# Altium schematic sheet dzmitry_tamashevich_schema.SchDoc
size 420 x 297 mm; CheckedBy: Шокурова; Author: Томашевич; Address1: Address1; Address2: Address2; Address3: Address3; Address4: Address4; SheetTotal: 1; Scale: 1:1; Letter1Column: T
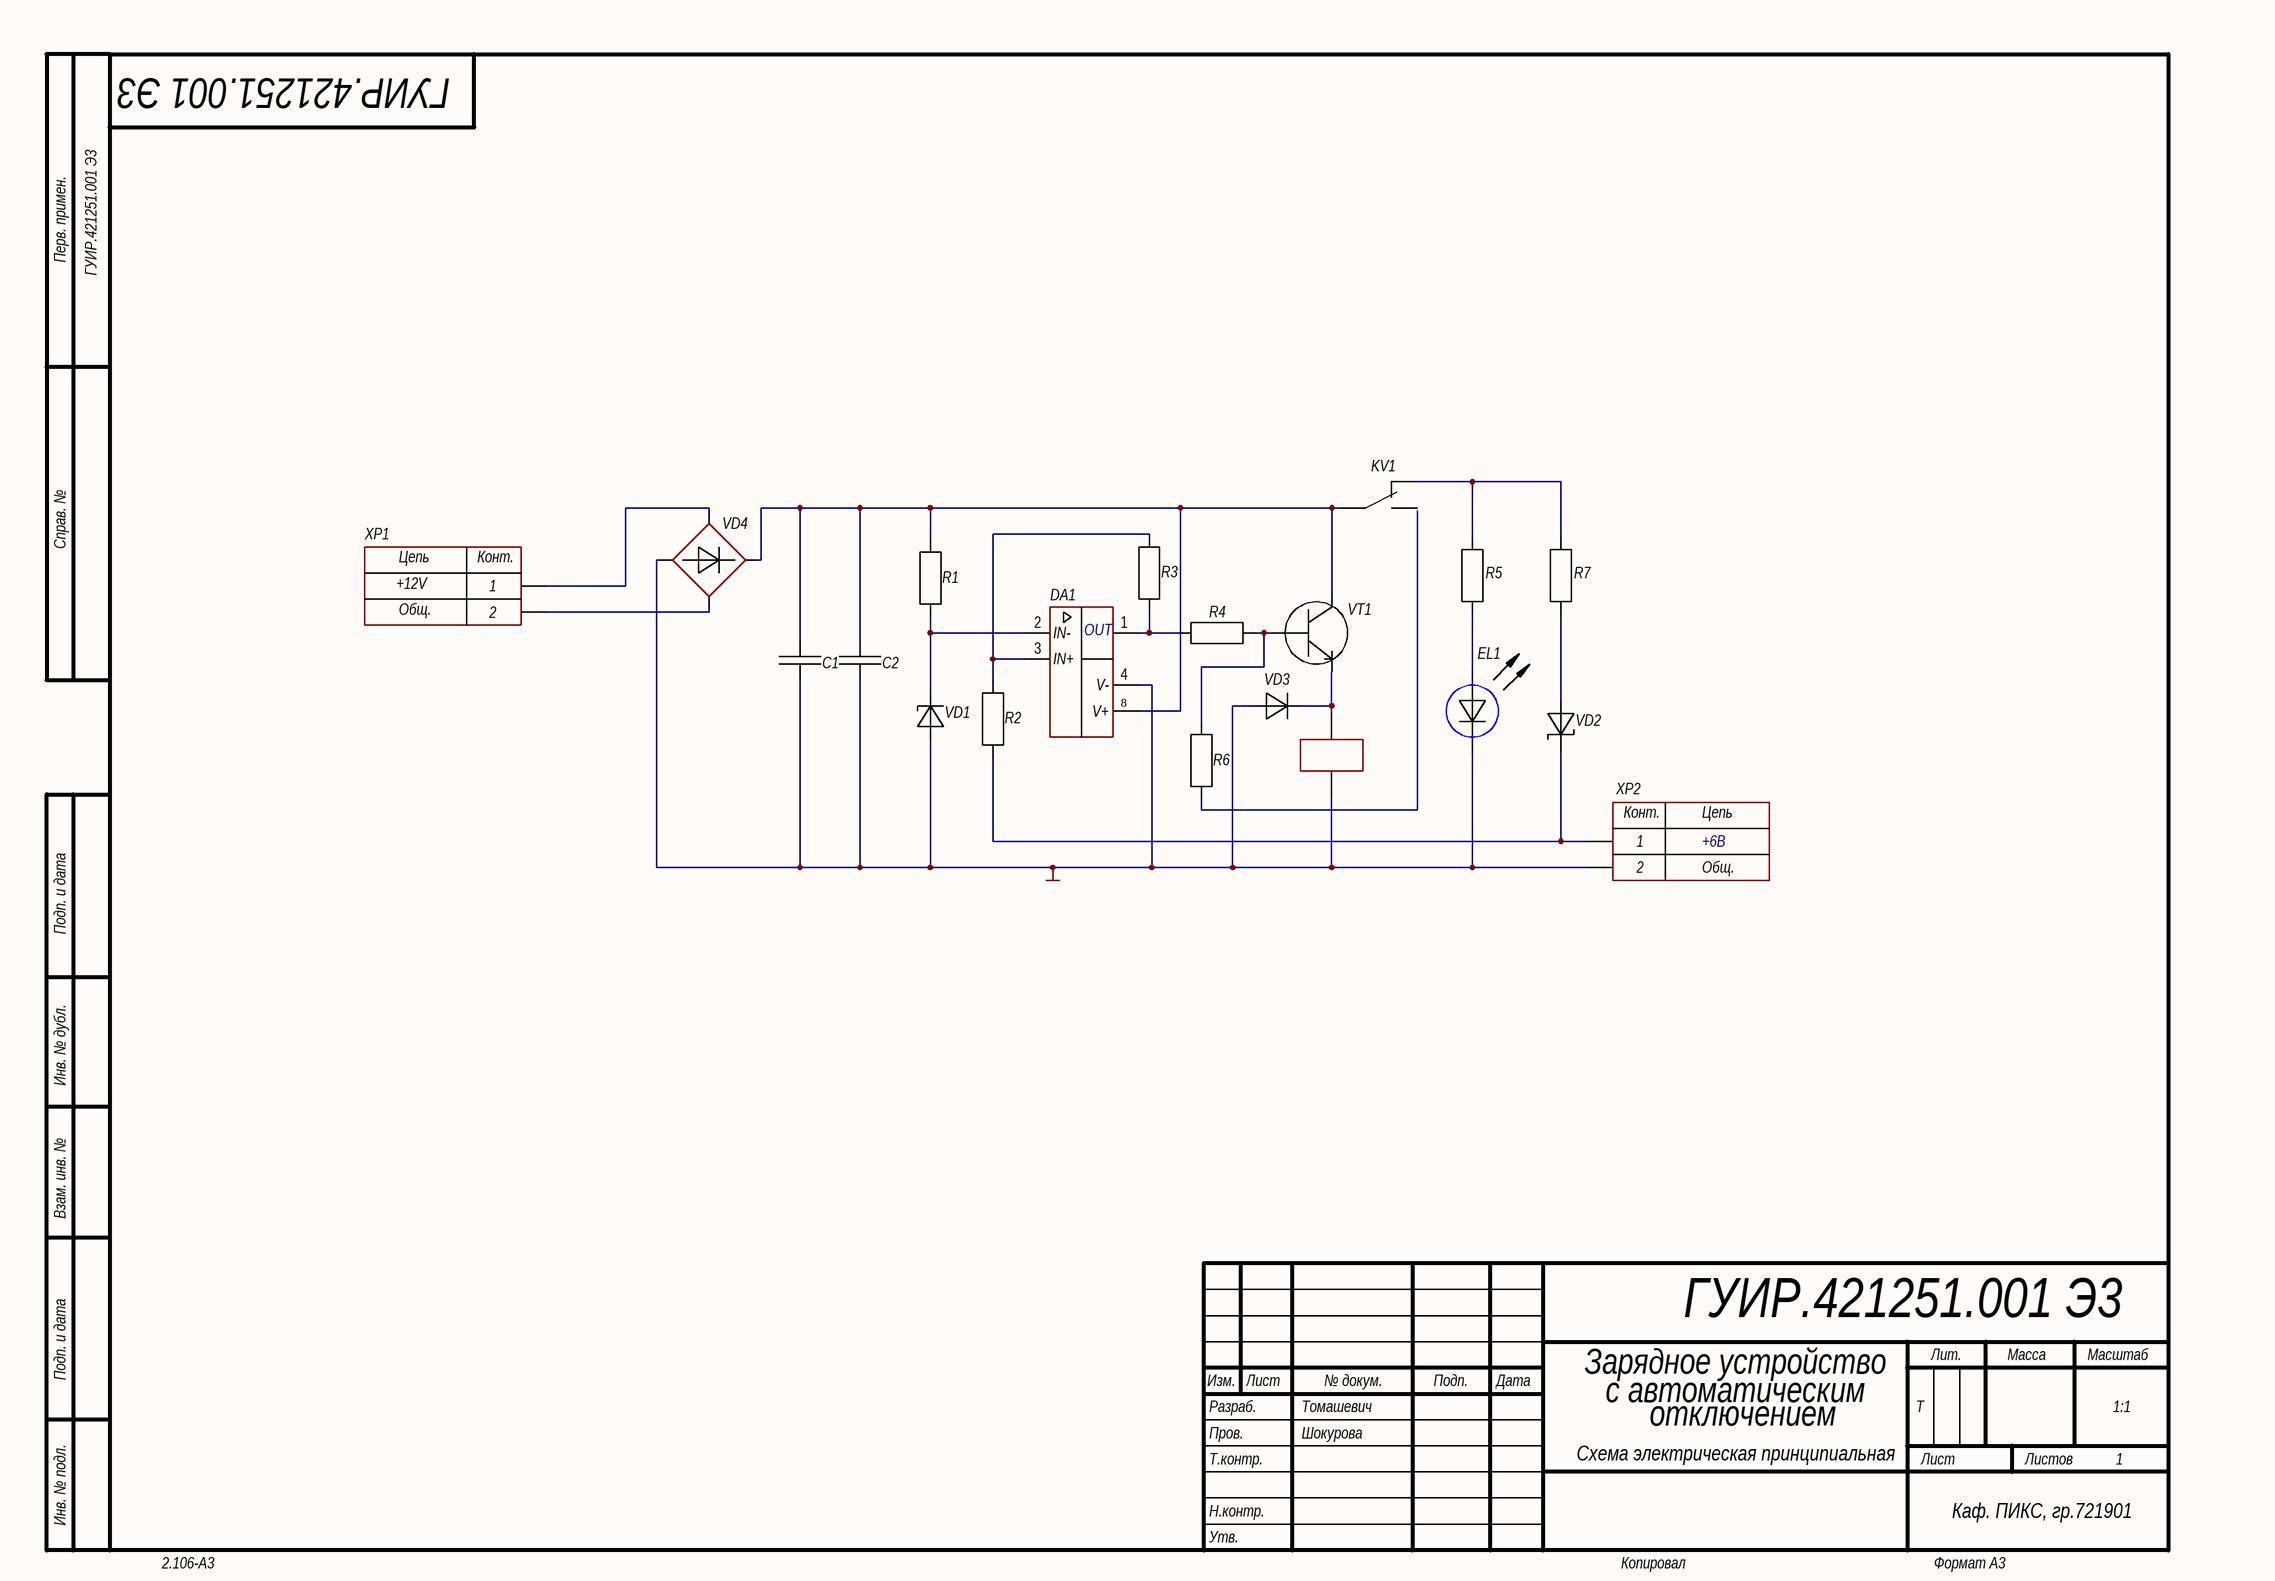
[diagram p0: dzmitry_tamashevich_schema.SchDoc]

## Parts
(Parts that share a designator on the sheet are numbered #1, #2 ... from top to bottom, then left to right.)
*#1  KV1
*#2  XP1
*#3  COMPONENT_1  (value not drawn)
C1  (no value)  [CAP: ECHU(X) D (2416)]
C2  (no value)  [CAP: ECHU(X) D (2416)]
DA1  (no value)  [SOT23-5]
EL1  (no value)  [LED: 0402B]
R1  *  [R1206]  (value not drawn)
R2  *  [R1206]  (value not drawn)
R3  *  [R1206]  (value not drawn)
R4  *  [R1206]  (value not drawn)
R5  *  [R1206]  (value not drawn)
R6  *  [R1206]  (value not drawn)
R7  *  [R1206]  (value not drawn)
VD1  (no value)  [DIODE: SMA]
VD2  (no value)  [DIODE: SMA]
VD3  (no value)  [DIODE: SMA]
VD4  (no value)  [DIODE: DF206S-G]
VT1  (no value)  [DPAK]
XP2  (no value)  [CON: 6PCV-02-006]

## Nets
GND: *#3.1 C1.2 C2.2 DA1.4(V-) EL1.2(C) VD1.1(A) VD3.1 VD4.1 XP2.2
Net*#1_3: *#1.3 C1.1 C2.1 DA1.8(V+) R1.2 VD4.3 VT1.1(B)
Net*#1_4: *#1.4 R5.2 R7.2
Net*#2_1: *#2.1 VD4.2
Net*#2_2: *#2.2 VD4.4
Net*#3_2: *#3.2 VD3.2 VT1.3(E)
NetDA1_1: DA1.1(OUT) R3.1 R4.1
NetDA1_2: DA1.2(IN-) R1.1 VD1.2(C)
NetDA1_3: DA1.3(IN+) R2.2 R3.2
NetEL1_1: EL1.1(A) R5.1
NetR2_1: R2.1 VD2.2 XP2.1
NetR4_2: R4.2 R6.2 VT1.2(C)
NetR7_1: R7.1 VD2.1

Not connected (* = marked no-connect by the designer): *#1 5; DA1 5 6 7; R6 1

## Notes on the sheet
- ГУИР.421251.001 Э3
- +12V
- (near DA1) OUT
- +6В
- Зарядное устройство
- Схема электрическая принципиальная
- с автоматическим
- отключением
- Каф. ПИКС, гр.721901
- Перв. примен.
- Справ. №
- Подп. и дата
- Инв. № дубл.
- Взам. инв. №
- Разраб.
- Изм.
- Лист
- № докум.
- Подп.
- Дата
- Лит.
- Масса
- Масштаб
- Пров.
- Т.контр.
- Листов
- Инв. № подл.
- Утв.
- Н.контр.
- 2.106-A3
- Копировал
- Формат А3
- (in symbol Connector_6PCV-02) Конт.; Цепь; Общ.
- (in symbol MY_connector) Цепь; Конт.; Общ.

## Library data of the parts
*#1 = my2
*#2 = MY_connector
*#3 = my1
C1 C2 = Film_SMD: Manufacturer: Panasonic Electronic Components; PartNumber: ECH-U1H104JX9; ValueManufacturerPartNumber: Film capacitor, 0.1µF, 50VDC, ±5%, *, 1913, -55...+125°C; TypeCapacitor: Film capacitor; Tolerance: ±5%; Voltage: 50VDC; Value: 0.1µF; Package: 1913; HelpURL: https://www.digikey.com/product-detail/en/panasonic-electronic-components/ECH-U1H104JX9/PCF1561CT-ND/1630924; Temperature: -55...+125°C; Impedance: *
DA1 = LM358: OP amplifier; Manufacturer: Texas Instruments; ValueManufacturerPartNumber: IC op amplifier, Rail-to-Rail, 1 MHz, 2.7...5.5V, -40...+125°C, SOT23-5; PartNumber: LMV321IDBVR; Supply: 2.7...5.5V; OutputType: Rail-to-Rail; GainBandwidth: 1 MHz; HelpURL: https://www.digikey.com/product-detail/en/texas-instruments/LMV321IDBVR/296-9567-1-ND/379849; Package: SOT23-5; ComponentType: IC op amplifier; Temperature: -40...+125°C
EL1 = LED_single: ValueManufacturerPartNumber: LED, Green, *, *, *, -55...+150°C; TypeDiode: LED; ColorParameter: Green; Manufacturer: *; Package: *; HelpURL: *; Temperature: -55...+150°C; Current: *; VoltageDrop: *; PartNumber: *; Color: GREEN
R1-R7 = MyResistor: Model: *; Manufacture: *; Case: *; Help URL: *; Value: *
VD1 = Zener_single: Manufacturer: Diodes Incorporated; ValueManufacturerPartNumber: Zener diode, 5.1V, 500mW, 0.9V, 17Ohm, SOD-123, -55...+150°C; PartNumber: MMSZ5231B-7-F; TypeDiode: Zener diode; Current: 500mW; VoltageDrop: 0.9V; RecoveryTime: 17Ohm; Voltage: 5.1V; Package: SOD-123; HelpURL: https://www.digikey.com/product-detail/en/diodes-incorporated/MMSZ5231B-7-F/MMSZ5231B-FDICT-ND/755506; Temperature: -55...+150°C
VD2 = Schottky_single: Manufacturer: Diodes Incorporated; ValueManufacturerPartNumber: Schottky diode, 80V, 500mA, 1V, 15pF, SOD-123, -55...+150°C; PartNumber: MBR0580S1-7; TypeDiode: Schottky diode; Voltage: 80V; Current: 500mA; VoltageDrop: 1V; RecoveryTime: 15pF; Package: SOD-123; HelpURL: https://www.digikey.com/product-detail/en/diodes-incorporated/MBR0580S1-7/MBR0580S1-7DICT-ND/5080371; Temperature: -55...+150°C
VD3 = Diode_single: Manufacturer: Micro Commercial; ValueManufacturerPartNumber: Single diode, 75V, 150mA, 1V, 4ns, SOD-323, -55...+150°C; PartNumber: 1N4148WX-TP; TypeDiode: Single diode; Voltage: 75V; Current: 150mA; VoltageDrop: 1V; RecoveryTime: 4ns; Package: SOD-323; HelpURL: https://www.digikey.com/product-detail/en/micro-commercial-co/1N4148WX-TP/1N4148WXTPMSCT-ND/717312; Temperature: -55...+150°C
VD4 = 1PH rectifier: Manufacturer: Comchip Technology; ValueManufacturerPartNumber: Single phase rectifier, 600V, 2A, 1.1V, 4-SMD, -55...+150°C; PartNumber: DF206ST-G; TypeDiode: Single phase rectifier; Voltage: 600V; Current: 2A; VoltageDrop: 1.1V; Package: 4-SMD; HelpURL: https://www.digikey.com/product-detail/en/comchip-technology/DF206ST-G/641-1425-1-ND/2208797; Temperature: -55...+150°C
VT1 = BJT_NPN_123: Manufacturer: ON Semiconductor; ValueManufacturerPartNumber: NPN transistor, 45V, 100mA, 100MHz, 300mW, 0.6V, 420, SOT-23, -55...+125°C; PartNumber: BC847CLT1G; TypeTransistor: NPN transistor; VoltageCE: 45V; CurrentCE: 100mA; VoltageSaturation: 0.6V; Frequency: 100MHz; CurrentGain: 420; MaxPower: 300mW; Package: SOT-23; HelpURL: https://www.digikey.com/product-detail/en/on-semiconductor/BC847CLT1G/BC847CLT1GOSCT-ND/917836; Temperature: -55...+125°C
XP2 = Connector_6PCV-02: Manufacturer: TE Connectivity; ValueManufacturerPartNumber: Connector, 2pin, 9.53mm, 300VAC, 25A; PartNumber: 6PCV-02-006; VoltageMax: 300VAC; Pitch: 9.53mm; CurrentMax: 25A; Multichannel: 2pin; HelpURL: https://www.digikey.com/products/en?keywords=6PCV-02-006; TypeConnector: Connector